# Altium schematic sheet mku_16_ch.SchDoc: =GlobalProjectName
size 209 x 297 mm; ApprovedBy: Утвердил; CheckedBy: Проверил; Author: Разработал; SheetNumber: 9; SheetTotal: 10; PageSetup: Record=PageOptions|CenterHorizontal=True|CenterVertical=True|PrintScale=1.00|XCorrection=1.00|YCorrection=1.00|PrintKind=1|BorderSize=5000000|LeftOffset=0|BottomOffset=0|Orientation=2|PaperLength=1000|PaperWidth=1000|Scale=100|PaperSource=15|PrintQuality=1200|MediaType=1|DitherType=10|PaperKind=A3|PrintScaleMode=1; Weight: -; ScaleFactor: -; NormInspection: Норм.Контр.
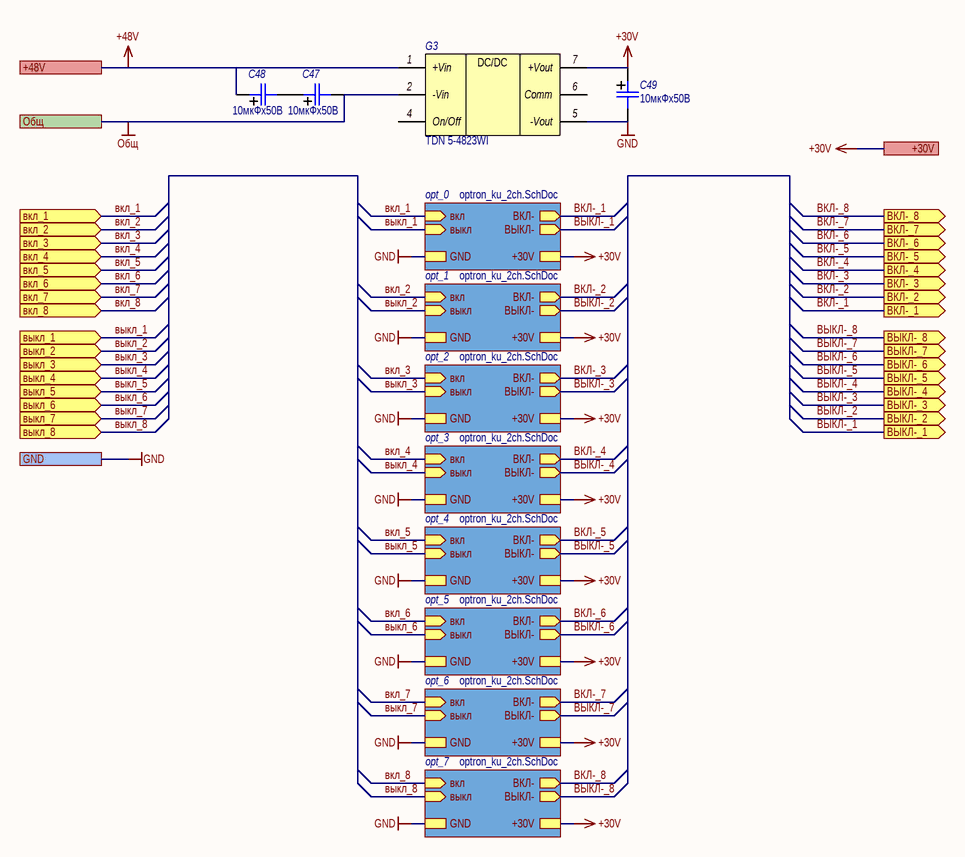
[diagram p0: mku_16_ch.SchDoc]

## Parts
C47  10мкФх50В  [SMD_size_C]
C48  10мкФх50В  [SMD_size_C]
C49  10мкФх50В  [SMD_size_C]
G3  Наименование: TDN 5-4823WI  [TDN_5_WISM]  (hidden comment: TDN 5-4821)

## Sub-sheets
opt_0 = optron_ku_2ch.SchDoc: GND, ВКЛ- (out), ВЫКЛ- (out), вкл (in), выкл (in), +30V
opt_1 = optron_ku_2ch.SchDoc: GND, ВКЛ- (out), ВЫКЛ- (out), вкл (in), выкл (in), +30V
opt_2 = optron_ku_2ch.SchDoc: GND, ВКЛ- (out), ВЫКЛ- (out), вкл (in), выкл (in), +30V
opt_3 = optron_ku_2ch.SchDoc: GND, ВКЛ- (out), ВЫКЛ- (out), вкл (in), выкл (in), +30V
opt_4 = optron_ku_2ch.SchDoc: GND, ВКЛ- (out), ВЫКЛ- (out), вкл (in), выкл (in), +30V
opt_5 = optron_ku_2ch.SchDoc: GND, ВКЛ- (out), ВЫКЛ- (out), вкл (in), выкл (in), +30V
opt_6 = optron_ku_2ch.SchDoc: GND, ВКЛ- (out), ВЫКЛ- (out), вкл (in), выкл (in), +30V
opt_7 = optron_ku_2ch.SchDoc: GND, ВКЛ- (out), ВЫКЛ- (out), вкл (in), выкл (in), +30V

## Ports
+30V, +48V, GND, ВКЛ-_1 (out), ВКЛ-_2 (out), ВКЛ-_3 (out), ВКЛ-_4 (out), ВКЛ-_5 (out), ВКЛ-_6 (out), ВКЛ-_7 (out), ВКЛ-_8 (out), вкл_1 (in), вкл_2 (in), вкл_3 (in), вкл_4 (in), вкл_5 (in), вкл_6 (in), вкл_7 (in), вкл_8 (in), ВЫКЛ-_1 (out), ВЫКЛ-_2 (out), ВЫКЛ-_3 (out), ВЫКЛ-_4 (out), ВЫКЛ-_5 (out), ВЫКЛ-_6 (out), ВЫКЛ-_7 (out), ВЫКЛ-_8 (out), выкл_1 (in), выкл_2 (in), выкл_3 (in), выкл_4 (in), выкл_5 (in), выкл_6 (in), выкл_7 (in), выкл_8 (in), Общ

## Nets
+30V: C49.1 G3.7(+Vout) ; port +30V, sheet opt_0/+30V, sheet opt_1/+30V, sheet opt_2/+30V, sheet opt_3/+30V, sheet opt_4/+30V, sheet opt_5/+30V, sheet opt_6/+30V, sheet opt_7/+30V
+48V: C48.1 G3.1(+Vin) ; port +48V
GND: C49.2 G3.5(-Vout) ; port GND, sheet opt_0/GND, sheet opt_1/GND, sheet opt_2/GND, sheet opt_3/GND, sheet opt_4/GND, sheet opt_5/GND, sheet opt_6/GND, sheet opt_7/GND
Общ: C47.2 G3.2(-Vin) ; port Общ
ВКЛ-_1: port ВКЛ-_1, sheet opt_0/ВКЛ-
ВКЛ-_2: port ВКЛ-_2, sheet opt_1/ВКЛ-
ВКЛ-_3: port ВКЛ-_3, sheet opt_2/ВКЛ-
ВКЛ-_4: port ВКЛ-_4, sheet opt_3/ВКЛ-
ВКЛ-_5: port ВКЛ-_5, sheet opt_4/ВКЛ-
ВКЛ-_6: port ВКЛ-_6, sheet opt_5/ВКЛ-
ВКЛ-_7: port ВКЛ-_7, sheet opt_6/ВКЛ-
ВКЛ-_8: port ВКЛ-_8, sheet opt_7/ВКЛ-
вкл_1: port вкл_1, sheet opt_0/вкл
вкл_2: port вкл_2, sheet opt_1/вкл
вкл_3: port вкл_3, sheet opt_2/вкл
вкл_4: port вкл_4, sheet opt_3/вкл
вкл_5: port вкл_5, sheet opt_4/вкл
вкл_6: port вкл_6, sheet opt_5/вкл
вкл_7: port вкл_7, sheet opt_6/вкл
вкл_8: port вкл_8, sheet opt_7/вкл
ВЫКЛ-_1: port ВЫКЛ-_1, sheet opt_0/ВЫКЛ-
ВЫКЛ-_2: port ВЫКЛ-_2, sheet opt_1/ВЫКЛ-
ВЫКЛ-_3: port ВЫКЛ-_3, sheet opt_2/ВЫКЛ-
ВЫКЛ-_4: port ВЫКЛ-_4, sheet opt_3/ВЫКЛ-
ВЫКЛ-_5: port ВЫКЛ-_5, sheet opt_4/ВЫКЛ-
ВЫКЛ-_6: port ВЫКЛ-_6, sheet opt_5/ВЫКЛ-
ВЫКЛ-_7: port ВЫКЛ-_7, sheet opt_6/ВЫКЛ-
ВЫКЛ-_8: port ВЫКЛ-_8, sheet opt_7/ВЫКЛ-
выкл_1: port выкл_1, sheet opt_0/выкл
выкл_2: port выкл_2, sheet opt_1/выкл
выкл_3: port выкл_3, sheet opt_2/выкл
выкл_4: port выкл_4, sheet opt_3/выкл
выкл_5: port выкл_5, sheet opt_4/выкл
выкл_6: port выкл_6, sheet opt_5/выкл
выкл_7: port выкл_7, sheet opt_6/выкл
выкл_8: port выкл_8, sheet opt_7/выкл
NetC47_1: C47.1 C48.2

Not connected (* = marked no-connect by the designer): G3 4(On/Off) 6(Comm)

## Notes on the sheet
- Подп. и дата
- Инв. № дубл.
- Взам. инв. №
- Инв. № подл.
- Изм.
- Лист
- № докум.
- Подп.
- Дата
- Форма 2а ГОСТ 2.104-2006
- Копировал
- Формат А4
- (in symbol TDN_5) DC/DC

## Library data of the parts
C47-C49 = Capacitor_pol: Polarized capacitor; Назначение: Поляризованный SMD-конденсатор; Наименование: Поляризованный конденсатор; Потребление, Вт: 0; Value: 10мкФх50В
G3 = TDN_5: DC/DC converter; Назначение: DC-DC преобразователь; Потребление, Вт: 0,01; DataSheet: https://www.tracopower.com/sites/default/files/products/datasheets/tdn5wi_datasheet.pdf